# Altium schematic sheet SPDIF.SchDoc
size A3; SheetNumber: 15; SheetTotal: 22
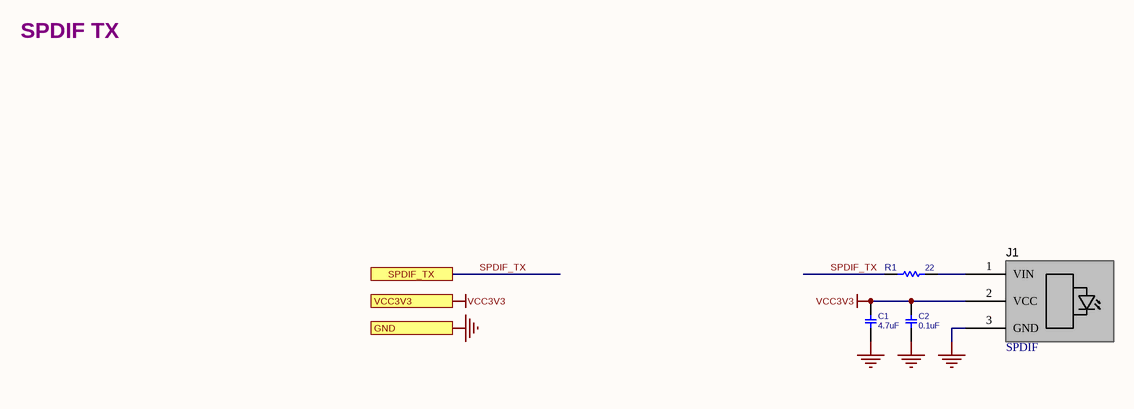
[diagram p0: SPDIF.SchDoc]

## Parts
C1  4.7uF  [C0402]
C2  0.1uF  [C0402]
J1  SPDIF  [SPDIF_T]
R1  22  [R0402]

## Ports
GND, SPDIF_TX, VCC3V3

## Nets
GND: C1.1 C2.1 J1.3(GND) ; port GND
VCC3V3: C1.2 C2.2 J1.2(VCC) ; port VCC3V3
SPDIF_TX: R1.2 ; port SPDIF_TX
NetJ1_1: J1.1(VIN) R1.1

## Notes on the sheet
- SPDIF TX

## Library data of the parts
C1 = CAP_SMD_MLCC: CAP, MLCC; PARAM: X5R, 20%; MANF_P#: CL05A475MP5NRNC; MANF: Samsung; PARAM2: 10v; PRICE: 10,000:	$0.013; ASSEMBLY: ASSEMBLY; VALUE: 4.7uF
C2 = CAP_SMD_MLCC: CAP, MLCC; PARAM: X5R, 10%; MANF_P#: GRM155R61E104; MANF: Murata; PARAM2: 25v; PRICE: 10,000:$0.006; ASSEMBLY: ASSEMBLY; VALUE: 0.1uF
J1 = SPDIF_T_PLT237: FIBER OPTIC TRANSMITTER IR, 25Mbps; MANF: Everlight; MANF_P#: PLT237/T10WH; PARAM2: 2.7~5Vcc; PARAM: 25Mbps, -40~85ºC; PRICE: 0.8$; VALUE: SPDIF
R1 = RES_SMD: RESISTOR, SMD; PARAM: 0.063W; DESC: DESCRIPTION; DIST#: MOUSER; PARAM2: 1%; MANF_P#: -; MANF: -; ASSEMBLY: ASSEMBLY; PRICE: 100= 0.3$; VALUE: 22